# EAGLE design powerboard (EAGLE 9.4.2)
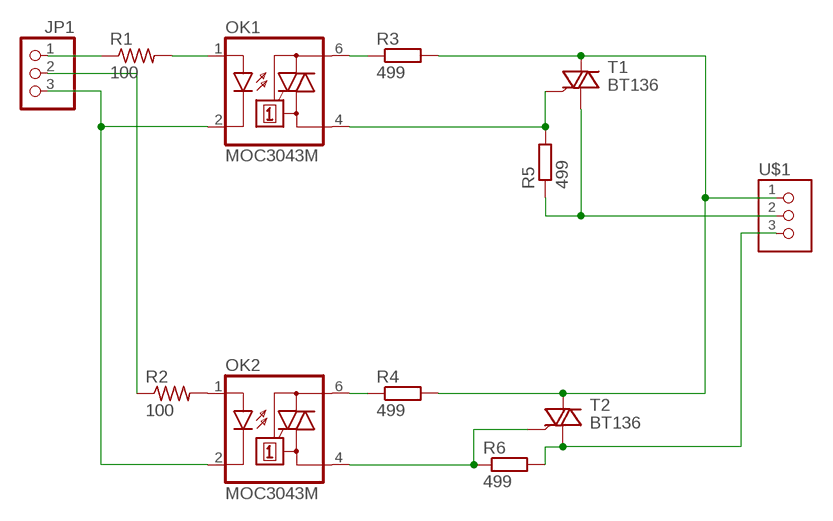
[diagram p0: schematic, sheet 1]

## Parts
JP1  PINHD-1X3/90  [1X03/90]
OK1  MOC3043M  [DIL06]
OK2  MOC3043M  [DIL06]
R1  100  RES-US1206FAB  [R1206FAB]
R2  100  RES-US1206FAB  [R1206FAB]
R3  499  R-EU_0207/12  [0207/12]
R4  499  R-EU_0207/12  [0207/12]
R5  499  R-EU_0207/12  [0207/12]
R6  499  R-EU_0207/12  [0207/12]
T1  BT136  [TO220AB]
T2  BT136  [TO220AB]
U$1  TERM-1X03'-FABLAB'  [ED555DS-3DS]

## Nets
N$1: JP1.3 OK1.2(C) OK2.2(C)
N$2: OK2.1(A) R2.2
N$3: JP1.2 R2.1
N$4: OK1.1(A) R1.2
N$5: JP1.1 R1.1
N$6: OK2.6(A2) R4.1
N$7: OK1.6(A2) R3.1
N$9: R3.2 R4.2 T1.2(A2) T2.2(A2) U$1.1
N$10: R5.1 T1.1(A1) U$1.2
N$11: R6.2 T2.1(A1) U$1.3
N$12: OK1.4(A1) R5.2 T1.3(G)
N$13: OK2.4(A1) R6.1 T2.3(G)

## Library data of the parts
JP1 = pinhead:PINHD-1X3: PIN HEADER
OK1 OK2 = optocoupler:MOC30*: 6-Pin DIP Zero-Cross Optoisolators Triac Driver Output (250/400 Volt Peak) Source: Data sheet <http://www.fairchildsemi.com/ds/MO/MOC3031M.pdf> The old path of data sheet not more available 2013-05-06.; MF: FAIRCHILD SEMICONDUCTOR; MPN: MOC3043-M; OC_FARNELL: 1021371; OC_NEWARK: 72K8900
R1 R2 = fab:RES-US: Resistor (US Symbol) Variants with postfix FAB are widened to allow the routing of internal traces
R3-R6 = rcl:R-EU_: RESISTOR, European symbol; SPICEPREFIX: R
T1 T2 = triac:BT136: Triac BT136 series E sensitive gate Source: http://www.nxp.com/acrobat_download/datasheets/BT136_SERIES_E_2.pdf
U$1 = fab:TERM-1X03: 3.5mm terminal block, 3 positions ED555-3DS as found in the fablab inventory. Made by Zaerc.

## Board
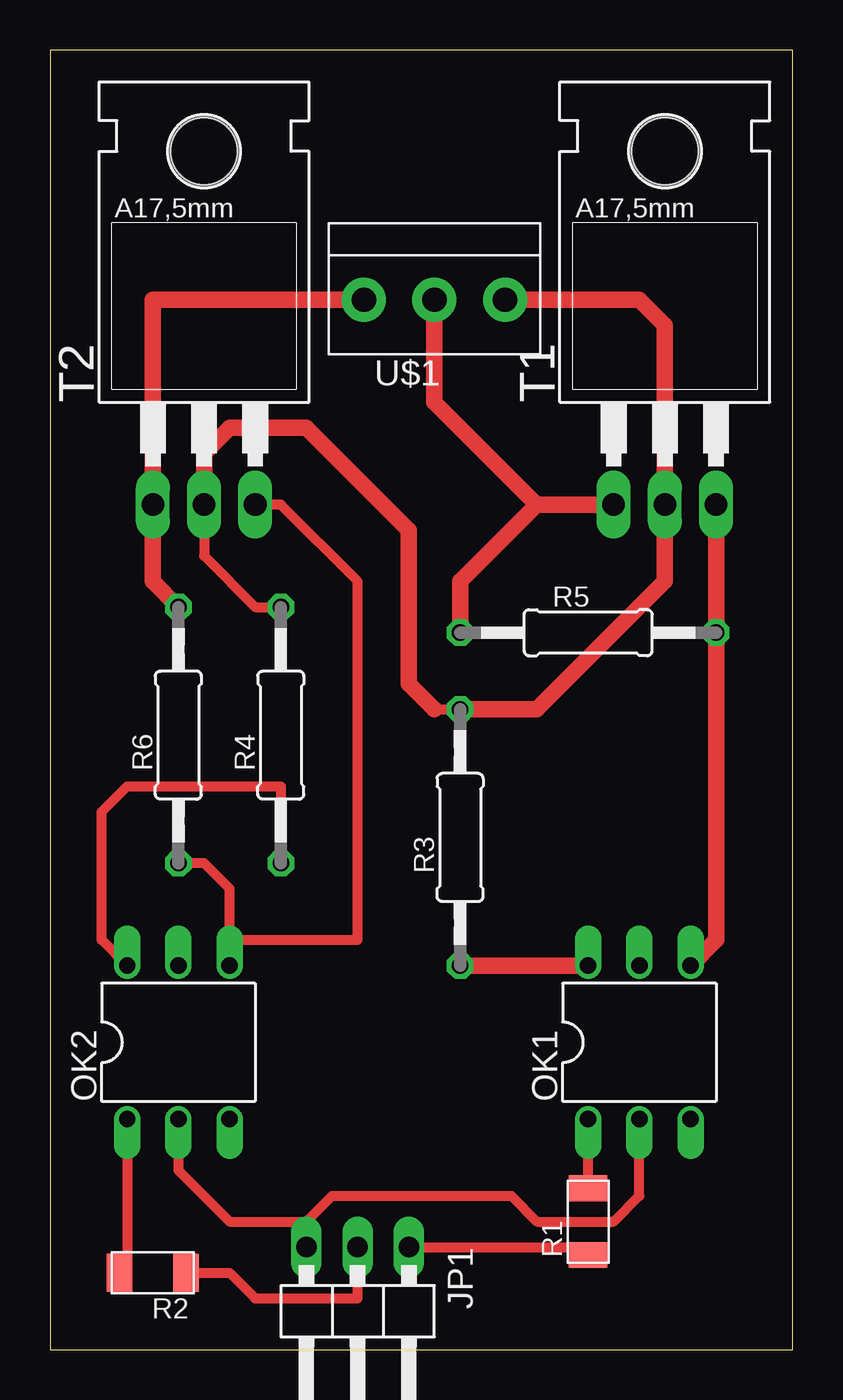
[diagram p1: board, top side]

Size 36.81 x 64.44 mm. Coordinates in mm from the lower left corner, seen from the top.
Outline: 0,0 36.81,0 36.81,64.44 0,64.44 0,0
Copper layers (1*16): Top 0.035mm / dielectric 1.5mm / Bottom 0.035mm
Design rules "default": minimum track width 6mil, minimum drill 0.35mm, track to track 6mil, track to pad 6mil, pad to pad 6mil, via to via 6mil, smd to smd 6mil, copper to edge 40mil, drill to drill 6mil, minimum pad ring 10mil, minimum via ring 8mil, stop-mask expansion 4mil, vias tented up to drill 0mil, thermal gap 10mil

### Footprints (pad centres in the part's own frame; a part is rotated, then mirrored left to right if it is on the bottom)
1X03/90 = drill 1.016 long: 1 -2.54,-3.81; 2 0,-3.81; 3 2.54,-3.81
DIL06 = drill 0.813 offset: 1 -2.54,-3.81; 2 0,-3.81; 3 2.54,-3.81; 4 2.54,3.81; 5 0,3.81; 6 -2.54,3.81
R1206FAB = smd 1.27 x 1.905: 1 -1.651,0; 2 1.651,0
0207/12 = drill 0.813 octagon: 1 -6.35,0; 2 6.35,0
TO220AB = drill 1.118 long: 1 -2.54,-6.35; 2 0,-6.35; 3 2.54,-6.35 | hole 3.302: 0,11.176
ED555DS-3DS = drill 1.2 pad 2.184: 1 -3.5,0; 2 0,0; 3 3.5,0

### Placement (x,y rotation side)
JP1  15.24,1.27 180 top
OK1  29.21,15.24 0 top
OK2  6.35,15.24 0 top
R1  26.67,6.35 90 top
R2  5.08,3.81 180 top
R3  20.32,25.4 90 top
R4  11.43,30.48 90 top
R5  26.67,35.56 0 top
R6  6.35,30.48 90 top
T1  30.48,48.26 0 top
T2  7.62,48.26 0 top
U$1  19.05,52.07 180 top

### Tracks (layer width: path | path; a pad name or v marks a point on that pad's centre or on a via)
N$1
  Top 0.508: OK2.2 6.35,8.89 8.89,6.35 12.7,6.35 | JP1.3 12.7,6.35 | 12.7,6.35 13.97,7.62 22.86,7.62 24.13,6.35 27.94,6.35 29.21,7.62 OK1.2
N$2
  Top 0.508: OK2.1 3.81,4.19 R2.2
N$3
  Top 0.508: R2.1 8.89,3.81 10.16,2.54 15.24,2.54 JP1.2
N$4
  Top 0.508: R1.2 OK1.1
N$5
  Top 0.508: JP1.1 26.29,5.08 R1.1
N$6
  Top 0.508: OK2.6 2.54,20.32 2.54,26.67 3.81,27.94 11.43,27.94 R4.1
N$7
  Top 0.813: R3.1 OK1.6
N$9
  Top 0.508: R4.2 10.16,36.83 7.62,39.37 T2.2 | 19.05,31.75 R3.2
  Top 0.813: R3.2 24.13,31.75 30.48,38.1 T1.2 30.48,50.8 29.21,52.07 U$1.1 | T2.2 7.62,44.45 8.89,45.72 12.7,45.72 17.78,40.64 17.78,33.02 19.05,31.75
N$10
  Top 0.813: R5.1 20.32,38.1 24.13,41.91 | T1.1 24.13,41.91 | 24.13,41.91 19.05,46.99 U$1.2
N$11
  Top 0.813: U$1.3 5.08,52.07 T2.1 5.08,38.1 R6.2
N$12
  Top 0.813: T1.3 R5.2 33.02,20.32 OK1.4
N$13
  Top 0.508: R6.1 7.62,24.13 8.89,22.86 8.89,20.32 | OK2.4 8.89,20.32 | 8.89,20.32 15.24,20.32 15.24,38.1 11.43,41.91 T2.3